# Altium schematic sheet CAN_UART.SchDoc
size A; SheetNumber: 3; SheetTotal: 3
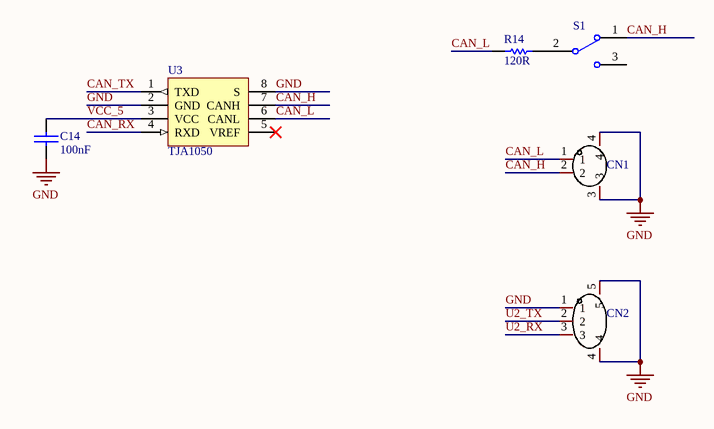
[diagram p0: CAN_UART.SchDoc]

## Parts
C14  100nF  [C 0603_L]
CN1  GH-1.25-2P  [GH1.25-WT-2P]  (value not drawn)
CN2  GH-1.25-3P  [GH1.25-WT-3P]  (value not drawn)
R14  120R  [0603R]
S1  SS-12F23  [SK12D07VG3]  (value not drawn)
U3  TJA1050  [SOP8_N]

## Nets
GND: C14.1 CN1.3 CN1.4 CN2.1 CN2.4 CN2.5 U3.2(GND) U3.8(S)
CAN_H: CN1.2 S1.1 U3.7(CANH)
CAN_L: CN1.1 R14.2 U3.6(CANL)
CAN_RX: U3.4(RXD)
CAN_TX: U3.1(TXD)
U2_RX: CN2.3
U2_TX: CN2.2
VCC_5: C14.2 U3.3(VCC)
NetR14_1: R14.1 S1.2

Not connected (* = marked no-connect by the designer): S1 3; U3 5(VREF)*

## Library data of the parts
C14 = CAP: 无极性电容
R14 = RES
S1 = SSW-1P: 1路波动开关; BOM名称: 波动开关; 版权归属: 封装库来自淘宝 ID：黄晶宝石; 学习资源: https://shop463601444.taobao.com
U3 = TJA1050: CAN总线收发芯片; 版权归属: 封装库来自淘宝 ID：黄晶宝石; BOM名称: CAN总线收发芯片; 学习资源: https://shop463601444.taobao.com